# Altium schematic sheet 06_rng.SchDoc
size A
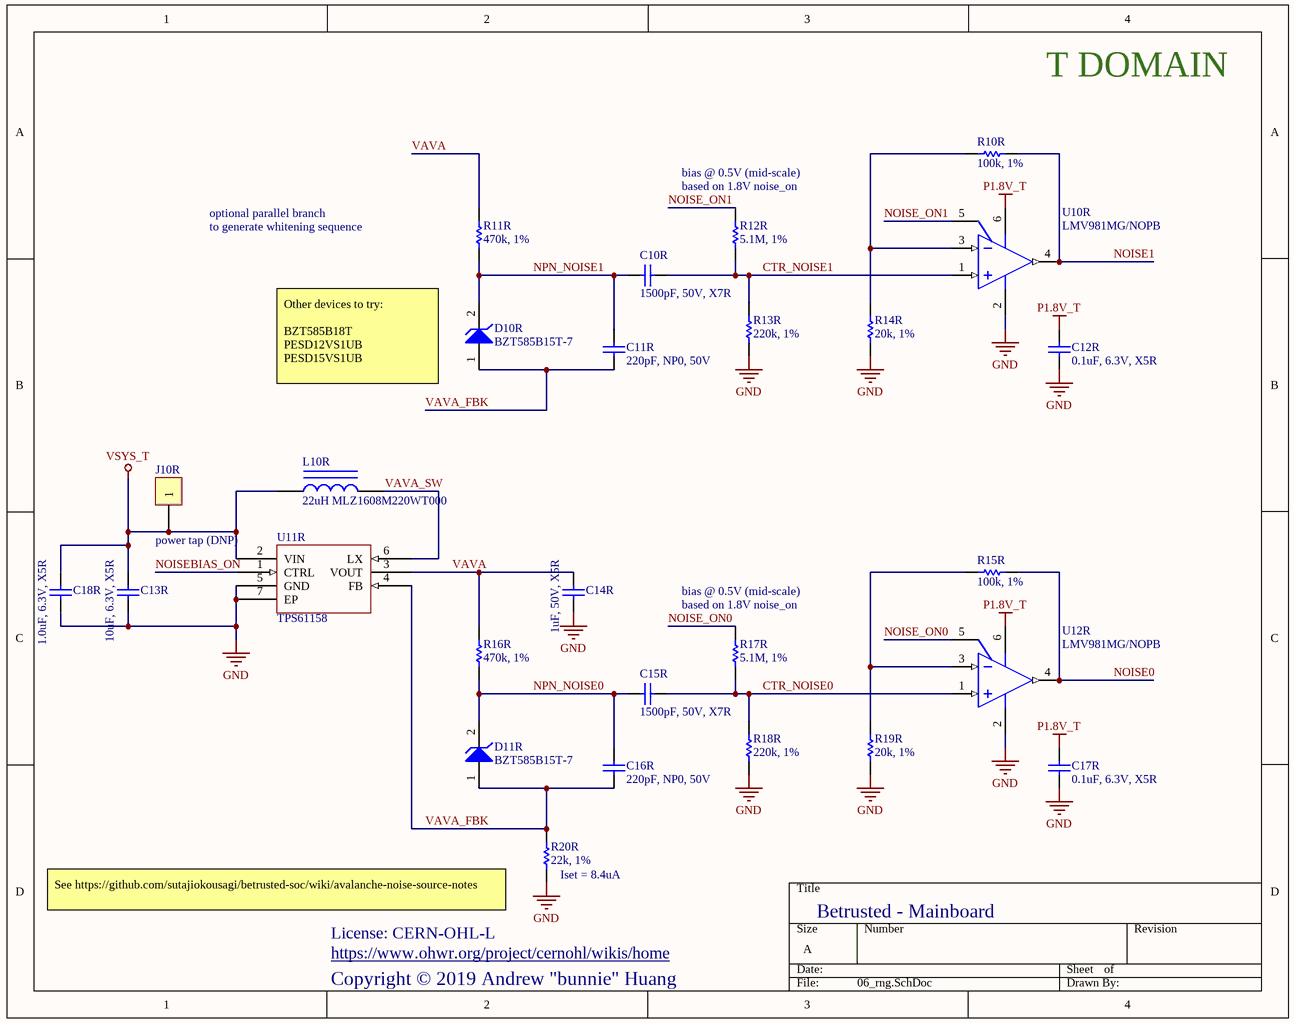
[diagram p0: 06_rng.SchDoc]

## Parts
C10R  1500pF, 50V, X7R  [B_CAP0402]
C11R  220pF, NP0, 50V  [B_CAP0402]
C12R  0.1uF, 6.3V, X5R  [B_CAP0201]
C13R  10uF, 6.3V, X5R  [B_CAP0603]
C14R  1uF, 50V, X5R  [B_CAP0603]
C15R  1500pF, 50V, X7R  [B_CAP0402]
C16R  220pF, NP0, 50V  [B_CAP0402]
C17R  0.1uF, 6.3V, X5R  [B_CAP0201]
C18R  1.0uF, 6.3V, X5R  [B_CAP0201]
D10R  BZT585B15T-7  [SOD523]
D11R  BZT585B15T-7  [SOD523]
J10R  power tap (DNP)  [RESTAP-0603]
L10R  22uH MLZ1608M220WT000  [INDC1608AN]
R10R  100k, 1%  [B_RES0201]
R11R  470k, 1%  [B_RES0402]
R12R  5.1M, 1%  [B_RES0402]
R13R  220k, 1%  [B_RES0201]
R14R  20k, 1%  [B_RES0201]
R15R  100k, 1%  [B_RES0201]
R16R  470k, 1%  [B_RES0402]
R17R  5.1M, 1%  [B_RES0402]
R18R  220k, 1%  [B_RES0201]
R19R  20k, 1%  [B_RES0201]
R20R  22k, 1%  [B_RES0402]
U10R  LMV981MG/NOPB  [DCK0006A_N]
U11R  TPS61158  [SON65P200X80_HS-7N]
U12R  LMV981MG/NOPB  [DCK0006A_N]

## Nets
GND: C12R.1 C13R.2 C14R.2 C17R.1 C18R.1 R13R.1 R14R.1 R18R.1 R19R.1 R20R.1 U10R.2(GND) U11R.5(GND) U11R.7(EP) U12R.2(GND)
P1.8V_T: C12R.2 C17R.2 U10R.6(VDD) U12R.6(VDD)
VSYS_T: C13R.1 C18R.2 J10R.1 L10R.1 U11R.2(VIN)
CTR_NOISE0: C15R.2 R17R.1 R18R.2 U12R.1(IN+)
CTR_NOISE1: C10R.2 R12R.1 R13R.2 U10R.1(IN+)
NOISE0: R15R.1 U12R.4(OUT)
NOISE1: R10R.1 U10R.4(OUT)
NOISE_ON0: R17R.2 U12R.5(~{SHDN})
NOISE_ON1: R12R.2 U10R.5(~{SHDN})
NOISEBIAS_ON: U11R.1(CTRL)
NPN_NOISE0: C15R.1 C16R.2 D11R.2(K) R16R.1
NPN_NOISE1: C10R.1 C11R.2 D10R.2(K) R11R.1
VAVA: C14R.1 R11R.2 R16R.2 U11R.3(VOUT)
VAVA_FBK: C11R.1 C16R.1 D10R.1(A) D11R.1(A) R20R.2 U11R.4(FB)
VAVA_SW: L10R.2 U11R.6(LX)
NetR10R_2: R10R.2 R14R.2 U10R.3(IN-)
NetR15R_2: R15R.2 R19R.2 U12R.3(IN-)

## Notes on the sheet
- T DOMAIN
- optional parallel branch
- to generate whitening sequence
- (near R12R) bias @ 0.5V (mid-scale)
- (near R12R) based on 1.8V noise_on
- Other devices to try:
  BZT585B18T
  PESD12VS1UB
  PESD15VS1UB
- (near R17R) bias @ 0.5V (mid-scale)
- (near R17R) based on 1.8V noise_on
- (near R20R) See https://github.com/sutajiokousagi/betrusted-soc/wiki/avalanche-noise-source-notes
- (near R20R) Iset = 8.4uA
- License: CERN-OHL-L
- https://www.ohwr.org/project/cernohl/wikis/home
- Betrusted - Mainboard
- Copyright © 2019 Andrew "bunnie" Huang

## Library data of the parts
C10R C15R = Cap Semi: Capacitor (Semiconductor SIM Model); MPN: CL05B152KB5NNNC; VENDOR: Samsung; MYPN: C-152-50-X7R-0402
C11R C16R = Cap Semi: Capacitor (Semiconductor SIM Model); MPN: CL05C221JB5NNNC; VENDOR: Samsung; MYPN: C-221-50-NP0-0402
C12R C17R = Cap Semi: Capacitor (Semiconductor SIM Model); MPN: CL03A104KQ3NNNC; VENDOR: Samsung; MYPN: C-104-6p3-X5R-0201
C13R = Cap Semi: Capacitor (Semiconductor SIM Model); MPN: CL10A106MQ8NNNC; VENDOR: Samsung; MYPN: C-106-6.3-X5R-0603
C14R = Cap Semi: Capacitor (Semiconductor SIM Model); MPN: CL10A105KB8NNNC; VENDOR: Samsung; MYPN: C-105-50-X5R-0603
C18R = Cap Semi: Capacitor (Semiconductor SIM Model); MPN: GRM033R60J105MEA2D; VENDOR: Murata; MYPN: C-105-6p3-X5R-0201
D10R D11R = D Zener: Zener Diode; MYPN: D-Z-15V-SOD523; VENDOR: Diodes Inc; Published: 8-Jun-2000; LatestRevisionDate: 17-Jul-2002; LatestRevisionNote: Re-released for DXP Platform.; PackageReference: DIODE-0.7; Publisher: Altium Limited; PackageDescription: Diode, Thru-Hole; 2 Leads; 0.7 in Pin Spacing; MPN: BZT585B15T-7
J10R = CON1: Connector; MYPN: J-TP-PWRTAP-0603; MPN: DNP; VENDOR: DNP
L10R = Inductor Iron: Magnetic-Core Inductor; VENDOR: TDK; MYPN: L-MLZ1608M220WT000; MPN: MLZ1608M220WT000
R10R R15R = Res1: Resistor; VENDOR: ANY; MYPN: R-104-1P-1_16W-0201; MPN: ANY
R11R R16R = Res1: Resistor; VENDOR: ANY; MYPN: R-474-1P-1_16W-0402; MPN: ANY
R12R R17R = Res1: Resistor; MPN: RMCF0402FT5M10; VENDOR: Stackpole; MYPN: R-515-1P-1_16W-0402
R13R R18R = Res1: Resistor; VENDOR: ANY; MYPN: R-224-1P-1_16W-0201; MPN: ANY
R14R R19R = Res1: Resistor; VENDOR: ANY; MYPN: R-203-1P-1_16W-0201; MPN: ANY
R20R = Res1: Resistor; VENDOR: ANY; MYPN: R-223-1P-1_16W-0402; MPN: ANY
U10R U12R = CMP-0055-01099-3: Single 1.8V, RRIO Operational Amplifiers with Shutdown, 6-pin SC-70, Pb-Free; PowerWise: N; PackageTopMarking: A77*XTT; VENDOR: Texas Instruments; ComponentLink1URL: http://www.ti.com/general/docs/lit/getliterature.tsp?genericPartNumber=LMV981-N&fileType=pdf; PackageDescription: Molded SC-70, 2 x 1.25 x .9mm, 6 Lead, 0.65mm Pitch; RoHS: Y; PinCount: 6; ComponentLink1Description: Datasheet URL; CompType: Amplifiers; Package Reference: DCK0006A; MPN: LMV981MG/NOPB
U11R = TPS61158: 30V WLED driver with integrated power diode; MPN: TPS61158DRVR; VENDOR: TI; MYPN: U-TPS61158DRVR